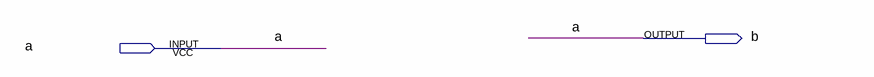
[diagram p0: schematic sheet]
// Quartus schematic test_wire_signal.bdf as structural Verilog: 0 symbols, 2 pins
module test_wire_signal (
  input  a,
  output b
);


  assign b = a;
endmodule
